# EAGLE design PulseFit-GFX (EAGLE 9.4.2)
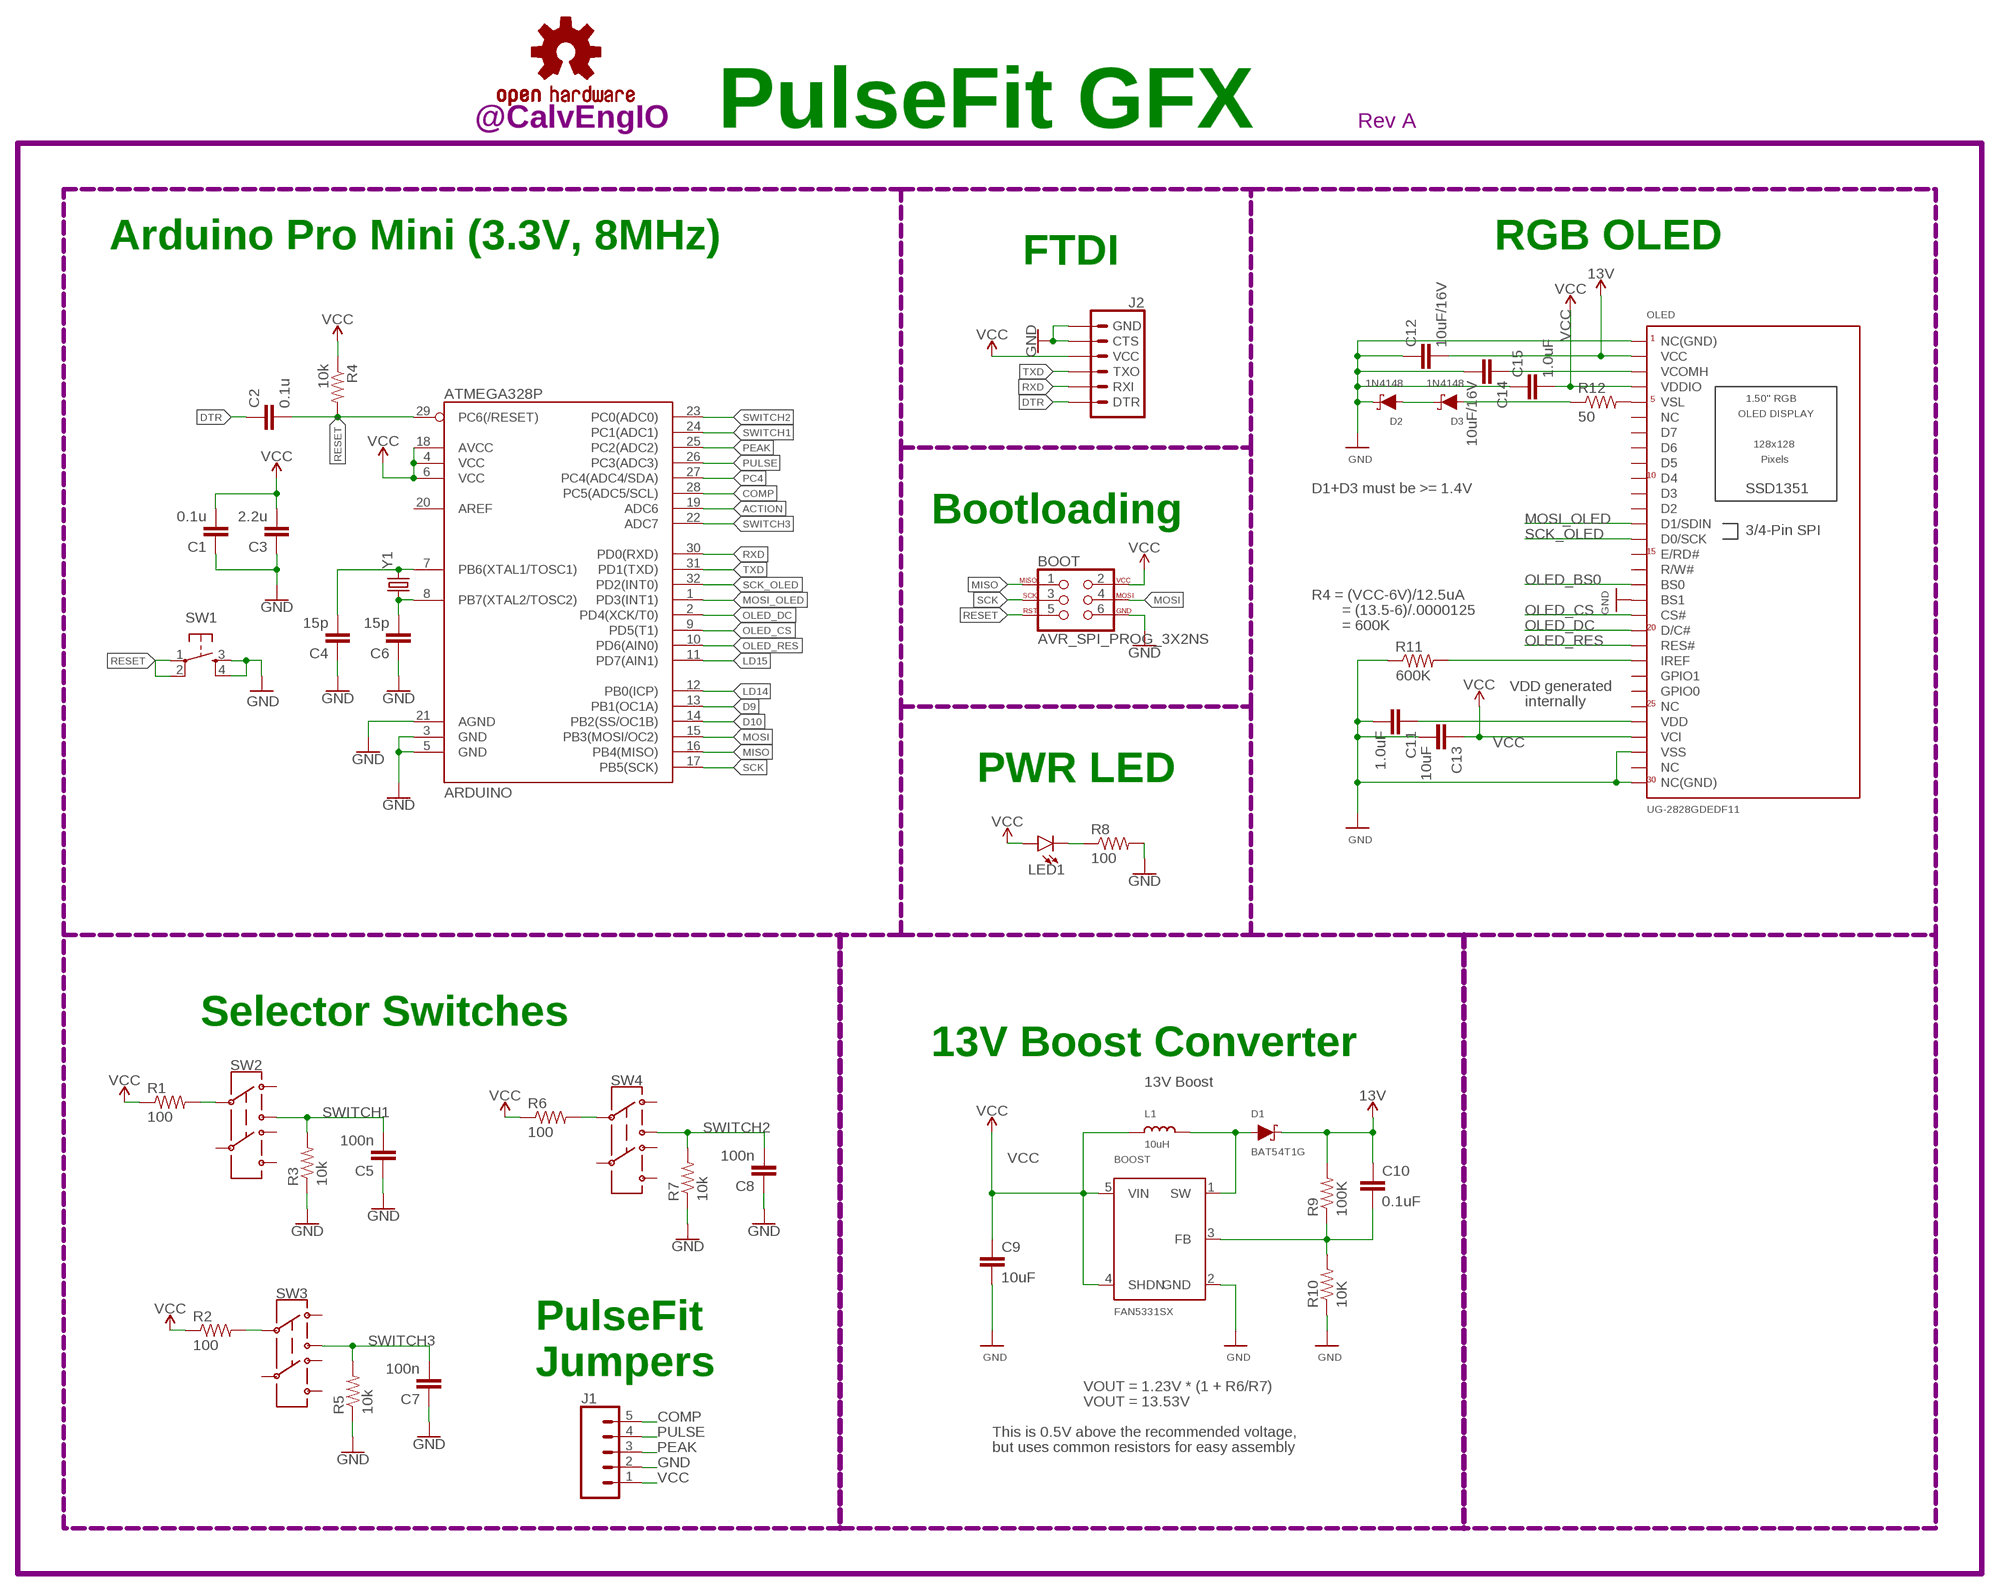
[diagram p0: schematic, sheet 1]

## Parts
ARDUINO  ATMEGA328P  ATMEGA328_SMT-OHMOD  [TQFP32-08]
BOOST  FAN5331SX  FAN5331  [SOT23-5@1]
BOOT  AVR_SPI_PROG_3X2NS  [2X3-NS]
C1  0.1u  CAPACITOR0603  [C0603]
C2  0.1u  CAPACITOR0603  [C0603]
C3  2.2u  CAPACITOR0805  [C0805]
C4  15p  CAPACITOR0603  [C0603]
C5  100n  CAPACITOR0603  [C0603]
C6  15p  CAPACITOR0603  [C0603]
C7  100n  CAPACITOR0603  [C0603]
C8  100n  CAPACITOR0603  [C0603]
C9  10uF  CAPACITOR0805  [C0805]
C10  0.1uF  CAPACITOR0603  [C0603]
C11  1.0uF  CAPACITOR0603  [C0603]
C12  10uF/16V  CAPACITOR0805  [C0805]
C13  10uF  CAPACITOR0805  [C0805]
C14  10uF/16V  CAPACITOR0805  [C0805]
C15  1.0uF  CAPACITOR0603  [C0603]
D1  BAT54T1G  SCHOTTKY-USC  [USC]
D2  1N4148  SCHOTTKY-USC  [USC]
D3  1N4148  SCHOTTKY-USC  [USC]
J1  CONN_05  [1X05]
J2  6_PIN_SERIAL_TARGETSILK  [6_PIN_SERIAL_TARGET_SIDE_W_SILK]
L1  10uH  INDUCTOR  [INDUCTOR_1007]
LED1  LED5MM  [LED_5MM]
LOGO1  CALVENGIO_HANDLEHANDLE.05  [CALVENGIO_HANDLE.05]
LOGO2  OSHW-LOGOS  [OSHW-LOGO-S]
LOGO3  REVISION.A  [REV.A]
OLED  UG-2828GDEDF11  DISP_OLED_UG-2828GDEDF11TOP  [FPC_XF2M-3015-1A]
R1  100  RESISTOR0603  [R0603]
R2  100  RESISTOR0603  [R0603]
R3  10k  RESISTOR0603  [R0603]
R4  10k  RESISTOR0603  [R0603]
R5  10k  RESISTOR0603  [R0603]
R6  100  RESISTOR0603  [R0603]
R7  10k  RESISTOR0603  [R0603]
R8  100  RESISTOR0603  [R0603]
R9  100K  RESISTOR0603  [R0603]
R10  10K  RESISTOR0603  [R0603]
R11  600K  RESISTOR0603  [R0603]
R12  50  RESISTOR0603  [R0603]
SW1  SPST-PTS830GG140  [BUTTON-GULLWING]
SW2  SWITCH.JS202011JXQNUPWARDS  [SWITCH.00]
SW3  SWITCH.JS202011JXQNUPWARDS  [SWITCH.00]
SW4  SWITCH.JS202011JXQNUPWARDS  [SWITCH.00]
Y1  CRYSTAL-CA-310  [CA-301]

## Nets
13V: C10.1 C12.2 D1.-(C) OLED.P$29(VCC) R9.2
ACTION: ARDUINO.19(ADC6)
COMP: ARDUINO.28(PC5(ADC5/SCL)) J1.5
D9: ARDUINO.13(PB1(OC1A))
D10: ARDUINO.14(PB2(SS/OC1B))
DTR: C2.1 J2.P$1(DTR)
GND: ARDUINO.3(GND) ARDUINO.5(GND) ARDUINO.21(AGND) BOOST.2(GND) BOOT.6 C1.1 C3.1 C4.1 C5.1 C6.1 C7.1 C8.1 C9.2 C11.2 C12.1 C13.2 C14.2 C15.1 D2.-(C) J1.2 J2.P$5(CTS) J2.P$6(GND) OLED.P$1(NC(GND)) OLED.P$3(VSS) OLED.P$13(BS1) OLED.P$30(NC(GND)) R3.1 R5.1 R7.1 R8.2 R10.1 R11.1 SW1.3 SW1.4
IREF: OLED.P$9(IREF) R11.2
LD14: ARDUINO.12(PB0(ICP))
LD15: ARDUINO.11(PD7(AIN1))
MISO: ARDUINO.16(PB4(MISO)) BOOT.1
MOSI: ARDUINO.15(PB3(MOSI/OC2)) BOOT.4
MOSI_OLED: ARDUINO.1(PD3(INT1)) OLED.P$18(D1/SDIN)
N$1: ARDUINO.7(PB6(XTAL1/TOSC1)) C4.2 Y1.2
N$2: ARDUINO.8(PB7(XTAL2/TOSC2)) C6.2 Y1.1
N$3: LED1.K(C) R8.1
N$4: C11.1 OLED.P$5(VDD)
N$5: BOOST.1(SW) D1.+(A) L1.P$2
N$6: OLED.P$26(VSL) R12.2
N$7: D3.+(A) R12.1
N$8: BOOST.3(FB) C10.2 R9.1 R10.2
N$9: R6.2 SW4.2
N$10: R2.2 SW3.2
N$11: R1.2 SW2.2
N$16: D2.+(A) D3.-(C)
OLED_BS0: OLED.P$14(BS0)
OLED_CS: ARDUINO.9(PD5(T1)) OLED.P$12(CS#)
OLED_DC: ARDUINO.2(PD4(XCK/T0)) OLED.P$11(D/C#)
OLED_RES: ARDUINO.10(PD6(AIN0)) OLED.P$10(RES#)
PC4: ARDUINO.27(PC4(ADC4/SDA))
PEAK: ARDUINO.25(PC2(ADC2)) J1.3
PULSE: ARDUINO.26(PC3(ADC3)) J1.4
RESET: ARDUINO.29(PC6(/RESET)) BOOT.5 C2.2 R4.2 SW1.1 SW1.2
RXD: ARDUINO.30(PD0(RXD)) J2.P$3(RXI)
SCK: ARDUINO.17(PB5(SCK)) BOOT.3
SCK_OLED: ARDUINO.32(PD2(INT0)) OLED.P$17(D0/SCK)
SWITCH1: ARDUINO.24(PC1(ADC1)) C5.2 R3.2 SW2.3
SWITCH2: ARDUINO.23(PC0(ADC0)) C8.2 R7.2 SW4.3
SWITCH3: ARDUINO.22(ADC7) C7.2 R5.2 SW3.3
TXD: ARDUINO.31(PD1(TXD)) J2.P$2(TXO)
VCC: ARDUINO.4(VCC) ARDUINO.6(VCC) ARDUINO.18(AVCC) BOOST.4(SHDN) BOOST.5(VIN) BOOT.2 C1.2 C3.2 C9.1 C13.1 C15.2 J1.1 J2.P$4(VCC) L1.P$1 LED1.A OLED.P$4(VCI) OLED.P$27(VDDIO) R1.1 R2.1 R4.1 R6.1
VCOMH1: C14.1 OLED.P$28(VCOMH)
Unconnected: ARDUINO.20(AREF) OLED.P$2(NC) OLED.P$6(NC) OLED.P$7(GPIO0) OLED.P$8(GPIO1) OLED.P$15(R/W#) OLED.P$16(E/RD#) OLED.P$19(D2) OLED.P$20(D3) OLED.P$21(D4) OLED.P$22(D5) OLED.P$23(D6) OLED.P$24(D7) OLED.P$25(NC) SW2.1 SW2.5 SW2.6 SW2.7 SW3.1 SW3.5 SW3.6 SW3.7 SW4.1 SW4.5 SW4.6 SW4.7

## Notes on the sheet
- PulseFit GFX
- Arduino Pro Mini (3.3V, 8MHz) | RGB OLED
- FTDI
- D1+D3 must be >= 1.4V
- Bootloading
- R4 = (VCC-6V)/12.5uA
- = (13.5-6)/.0000125
- = 600K
- VDD generated
- internally
- PWR LED
- Selector Switches
- 13V Boost Converter
- 13V Boost
- PulseFit
  Jumpers
- VOUT = 1.23V * (1 + R6/R7)
- VOUT = 13.53V
- This is 0.5V above the recommended voltage,
- but uses common resistors for easy assembly

## Library data of the parts
ARDUINO = SparkFun-DigitalIC:ATMEGA328_SMT-OHMOD: 32-Pin Atmega328 part Commonly used on Arduino compatible boards Available in QFP and QFN packages TQFP is IC-09069 QFN is non-stock; PROD_ID: IC-09069
BOOST = microbuilder:FAN5331: FAN5331 - LED/OLED 20V Boost Converter Digikey: FAN5331SXCT-ND
BOOT = CalvEngIO-Connectors:AVR_SPI_PROG_3X2: AVR ISP 6 Pin This is the reduced ISP connector for AVR programming. Common on Arduino. This footprint will take up less PCB space and can be used with a 10-pin to 6-pin adapter such as SKU: BOB-08508 **Special note about "TEST_POINT" package. The stop mask is on the top side, so if you want your programming test points to be on the bottom of your board, make sure to place this package on the bottom side of the board. This also ensure that the orientation to program from the bottom side will be correct. SparkFun Products: SparkFun ISP Pogo Adapter <https://www.sparkfun.com/products/11591> - NS Tiny AVR Programmer <https://www.sparkfun.com/products/11801> -PTH
C1-C15 = CalvEngIO-Passives:CAPACITOR
D1-D3 = CalvEngIO-DiscreteSemi:SCHOTTKY: Schottky diode A Schottky diode is a semiconductor diode which has a low forward voltage drop and a very fast switching action. Example: Digi-Key Part Number: RB161MM-20CT-ND
J1 = CalvEngIO-Connectors:CONN_05: Multi connection point. Often used as Generic Header-pin footprint for 0.1 inch spaced/style header connections On any of the 0.1 inch spaced packages, you can populate with these: Break Away Headers - Straight <https://www.sparkfun.com/products/116> (PRT-00116) Break Away Male Headers - Right Angle <https://www.sparkfun.com/products/553> (PRT-00553) Female Headers <https://www.sparkfun.com/products/115> (PRT-00115) Break Away Headers - Machine Pin <https://www.sparkfun.com/products/117> (PRT-00117) Break Away Female Headers - Swiss Machine Pin <https://www.sparkfun.com/products/743> (PRT-00743) For SCREWTERMINALS and SPRING TERMINALS visit here: Screw Terimnals on SparkFun.com <https://www.sparkfun.com/search/results?term=Screw+Terminals> (5mm/3.5mm/2.54mm spacing) This device is also useful as a general connection point to wire up your design to another part of your project. Our various solder wires solder well into these plated through hole pads. Hook-Up Wire - Assortment (Stranded, 22 AWG) <https://www.sparkfun.com/products/11375> (PRT-11375) Hook-Up Wire - Assortment (Solid Core, 22 AWG) <https://www.sparkfun.com/products/11367> (PRT-11367) View the entire wire category on our website here <https://www.sparkfun.com/categories/141> Special notes: Molex polarized connector foot print use with SKU : PRT-08231 with associated crimp pins and housings. 1MM SMD Version SKU: PRT-10208
J2 = SparkFun-Connectors:6_PIN_SERIAL_TARGET: 6-pin header connection for use with the "FTDI BASIC" pinout - TARGET SIDE. Also known as "Arduino Serial Program Header". It is used to mate with our FTDI Basic serial programmers using the Arduino IDE. Note, this device has "TARGET" in the name. It is intended to be used on a design that contains a target micro-controller that you wish to program. The "sister" device, named "CABLE" is inteneded to be used on a design that usually lives on the end of your USB cable and prvides the converter chip (FTDI232 or FTDI231x) to commnicate serial RX/TX. You can populate with some of these: Break Away Headers - Straight <https://www.sparkfun.com/products/116> (PRT-00116) For reference (or to suit your programming needs) check out these designs: SparkFun FTDI Basic Breakout - 5V <https://www.sparkfun.com/products/9716> (DEV-09716) SparkFun FTDI Basic Breakout - 3.3V <https://www.sparkfun.com/products/9873> (DEV-09873) SparkFun FTDI SmartBasic <https://www.sparkfun.com/products/12935> (DEV-12935) SparkFun Beefy 3 - FTDI Basic Breakout <https://www.sparkfun.com/products/13746> (DEV-13746)
L1 = microbuilder:INDUCTOR: Inductors 0603: 10nH Ceramic Inductor - microwire antenna/RF (Digikey: 712-1434-2-ND) 0805: 560nH Ceramic Inductor - RF (Digikey: 553-1047-1-ND) 270nH Ceramic Inductor - Q = 40@250MHz, +-5%, 1 Ohm DC Resistance (Digikey: 535-10506-2-ND) 1007 (2518 Metric) SMT: 10µH 10% 250mOhm 820mA 1007 Inductor (Digikey: 587-2189-1-ND) 22µH 10% 500mOhm 580mA 1007 Inductor (Digikey: 587-2190-1-ND) 47µH 10% 950mOhm 420mA 1007 Inductor (Digikey: 587-2191-1-ND) 47µH 5% 100mOhm 1A 1008 Inductor (Digikey: 732-1816-1-ND) 5.0x5.0mm (Taiyo Yuden NR5040 Series) 6.8µH 20% 2.3A 64mOhm Inductor (Digikey: 587-2374-2-ND) 5.0x5.0mm (TDK VLC5045 Series) 4.7µH 20% 3.3A 34mOhm Inductor (Digikey: 445-6526-1-ND) 6.8µH 20% 2.7A 46mOhm Inductor (Digikey: 445-6527-1-ND) 6.0x6.0mm (TDK VLC6045 Series) 4.7µH 20% 3.8A 27mOhm Inductor (Digikey: 445-6538-2-ND) 6.8µH 20% 3A 41mOhm Inductor (Digikey: 445-6540-1-ND) 6.2µH 30% 2.2A 45mOhm Inductor (Digikey: SRR5028-6R2YCT-ND) - Not TDK VLC6045 but footprint should match 6.0x6.0mm (TDK SLF6045 Series) 6.8uH 30% 2A 33mOhm Inductor (Digikey: 445-4572-1-ND, Mouser: 810-SLF645T6R8N2R0PF) 6.0x6.0mm (Sumida CDRH5D28 Series) 6.2uH 30% 1.8A 45mOhm Inductor (Digikey: 308-1542-1-ND) Taiyo Yuden NR3015T2R2M - 2.2uH 20% 1.5A (Digikey: 587-1648-2-ND, Mouser: 963-NR3015T2R2M) - Used with TI TPS62172 CoilCraft RFID Transponder Coil - MA5532-AE (For use with AS3935 Lightning Sensor)
LED1 = CalvEngIO-LED:LED: LED (Generic) Standard schematic elements and footprints for 5mm, 3mm, 1206, and 0603 sized LEDs. Generic LEDs with no color specified. LTST-C190KGKT: arrow indicates cathode
LOGO1 = CalvEngIO-Logos:CALVENGIO_HANDLE
LOGO2 = CalvEngIO-Logos:OSHW-LOGO: Open-Source Hardware (OSHW) Logo This logo indicates the piece of hardware it is found on incorporates a OSHW license and/or adheres to the definition of open source hardware found here: http://freedomdefined.org/OSHW
LOGO3 = CalvEngIO-Logos:REVISION.A
OLED = microbuilder:DISP_OLED_UG-2828GDEDF11: 128x128 1.5" RGB OLED - UG-2828GDEDF11 30-Pin 0.5mm Pitch FPC Cable (Top+Bottom Contacts) - OMRON XF2M-3015-1A (Digikey: OR723TR-ND) This FPC connector has contacts on the top and bottom, but the appropriate pin needs to be selected depending on whether the OLED will be inserted right-side up (use the TOP pinout) or upside-down (use the BOTTOM pinout).
R1-R12 = CalvEngIO-Passives:RESISTOR
SW1 = CalvEngIO-Switches:SPST-PTS830GG140
SW2-SW4 = CalvEngIO-Switches:SWITCH.JS202011JXQN: Manufacturer's Part Numer: JS202011JAQN for right angle throw JS202011JCQN for top side throw
Y1 = CalvEngIO-Clocks:CRYSTAL-CA-310

## Board
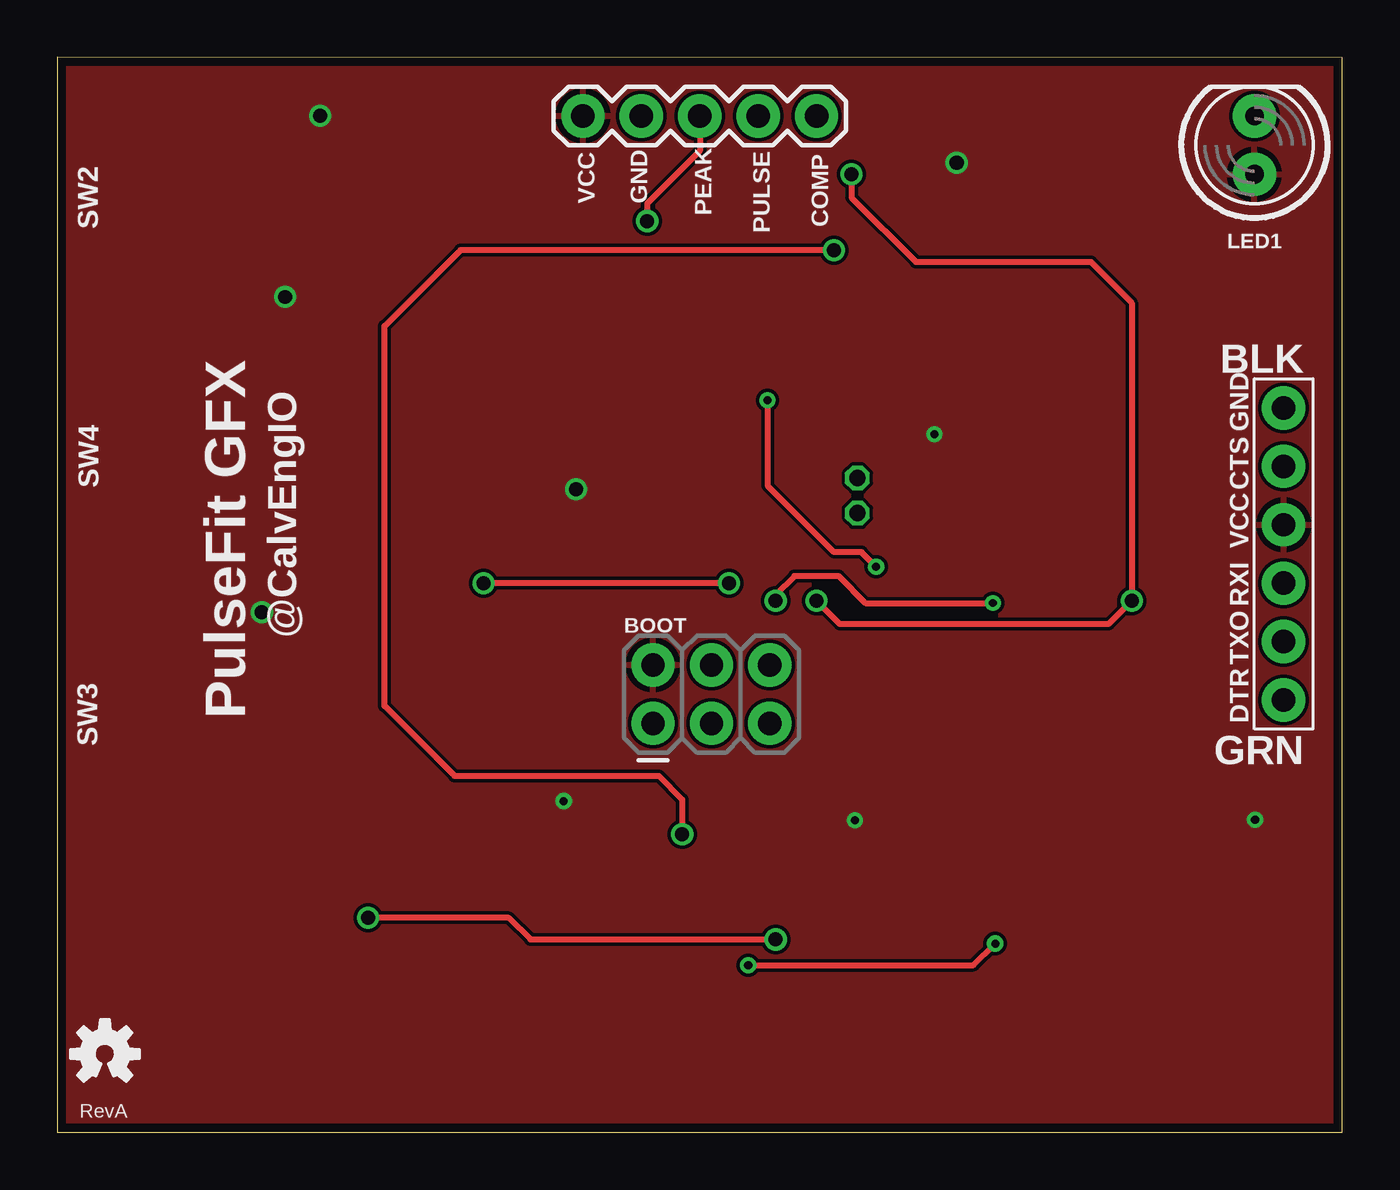
[diagram p1: board, top side]
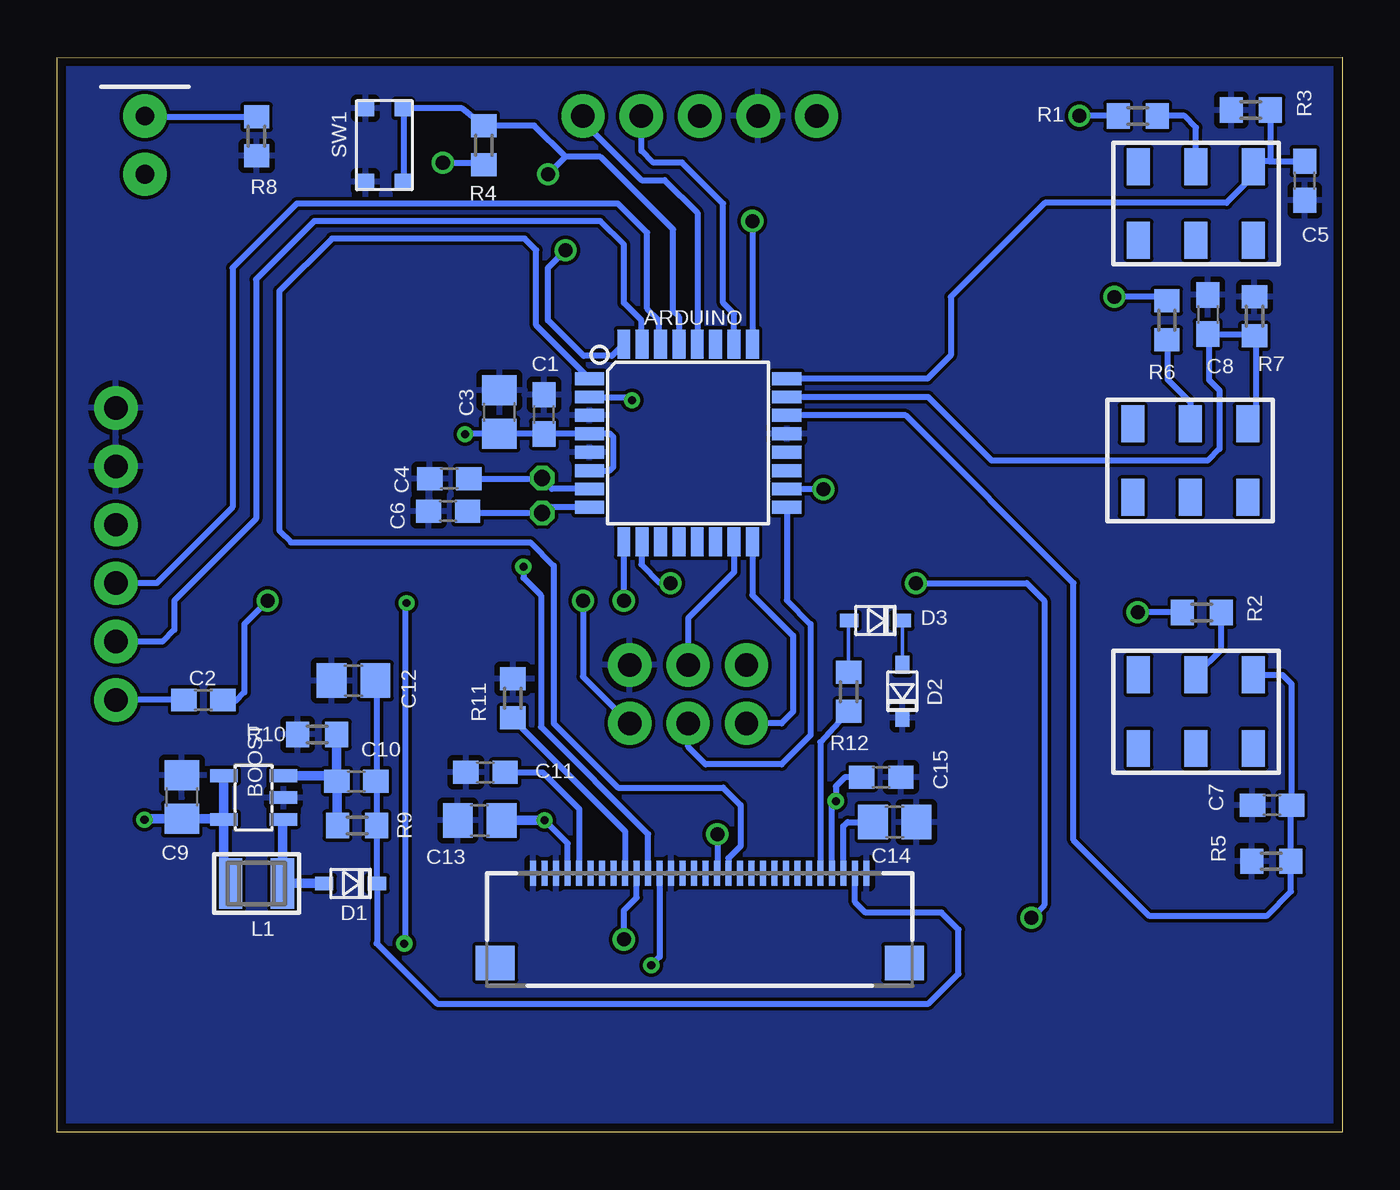
[diagram p2: board, bottom side, seen from below]

Size 55.88 x 46.74 mm. Coordinates in mm from the lower left corner, seen from the top.
Outline: 0,0 55.88,0 55.88,46.73 0,46.74 0,0
Copper layers (1*16): Top 0.0356mm / dielectric 1.5011mm / Bottom 0.0356mm
Design rules "LaenPCBOrder": minimum track width 6mil, minimum drill 13mil, track to track 6mil, track to pad 6mil, pad to pad 6mil, via to via 6mil, smd to smd 6mil, copper to edge 15mil, drill to drill 6mil, minimum pad ring 7mil, minimum via ring 7mil, stop-mask expansion 3mil, vias tented up to drill 0mil, thermal gap 10mil

### Footprints (pad centres in the part's own frame; a part is rotated, then mirrored left to right if it is on the bottom)
TQFP32-08 = smd 1.27 x 0.559: 1 -4.293,2.8; 2 -4.293,2; 3 -4.293,1.2; 4 -4.293,0.4; 5 -4.293,-0.4; 6 -4.293,-1.2; 7 -4.293,-2; 8 -4.293,-2.8; 17 4.293,-2.8; 18 4.293,-2; 19 4.293,-1.2; 20 4.293,-0.4; 21 4.293,0.4; 22 4.293,1.2; 23 4.293,2; 24 4.293,2.8 | smd 0.559 x 1.27: 9 -2.8,-4.293; 10 -2,-4.293; 11 -1.2,-4.293; 12 -0.4,-4.293; 13 0.4,-4.293; 14 1.2,-4.293; 15 2,-4.293; 16 2.8,-4.293; 25 2.8,4.293; 26 2,4.293; 27 1.2,4.293; 28 0.4,4.293; 29 -0.4,4.293; 30 -1.2,4.293; 31 -2,4.293; 32 -2.8,4.293
SOT23-5@1 = smd 0.55 x 1.2: 1 -0.95,-1.3; 2 0,-1.3; 3 0.95,-1.3; 4 0.95,1.3; 5 -0.95,1.3
2X3-NS = drill 1.016 pad 1.88: 1 -2.54,-1.27; 2 -2.54,1.27; 3 0,-1.27; 4 0,1.27; 5 2.54,-1.27; 6 2.54,1.27
C0603 = smd 1.1 x 1: 1 -0.85,0; 2 0.85,0
C0805 = smd 1.3 x 1.5: 1 -0.95,0; 2 0.95,0
USC = smd 0.8 x 0.6: + -1.15,0; - 1.15,0
1X05 = drill 1.016 pad 1.88: 1 0,0; 2 2.54,0; 3 5.08,0; 4 7.62,0; 5 10.16,0
6_PIN_SERIAL_TARGET_SIDE_W_SILK = drill 1.016 pad 1.88: P$1 -6.35,0; P$2 -3.81,0; P$3 -1.27,0; P$4 1.27,0; P$5 3.81,0; P$6 6.35,0
INDUCTOR_1007 = smd 1.016 x 2.2: P$1 -1.127,0; P$2 1.127,0
LED_5MM = drill 0.813 pad 1.88: A -1.27,0; K 1.27,0
FPC_XF2M-3015-1A = smd 0.25 x 1.1: P$1 7.25,-2.63; P$2 6.75,-2.63; P$3 6.25,-2.63; P$4 5.75,-2.63; P$5 5.25,-2.63; P$6 4.75,-2.63; P$7 4.25,-2.63; P$8 3.75,-2.63; P$9 3.25,-2.63; P$10 2.75,-2.63; P$11 2.25,-2.63; P$12 1.75,-2.63; P$13 1.25,-2.63; P$14 0.75,-2.63; P$15 0.25,-2.63; P$16 -0.25,-2.63; P$17 -0.75,-2.63; P$18 -1.25,-2.63; P$19 -1.75,-2.63; P$20 -2.25,-2.63; P$21 -2.75,-2.63; P$22 -3.25,-2.63; P$23 -3.75,-2.63; P$24 -4.25,-2.63; P$25 -4.75,-2.63; P$26 -5.25,-2.63; P$27 -5.75,-2.63; P$28 -6.25,-2.63; P$29 -6.75,-2.63; P$30 -7.25,-2.63 | smd 1.7 x 1.5: SUPPORT1 8.9,1.27; SUPPORT2 -8.9,1.27
R0603 = smd 1 x 1.1: 1 -0.85,0; 2 0.85,0
BUTTON-GULLWING = smd 0.7 x 0.75: 1 -1.6,0.825; 2 1.6,0.825; 3 -1.6,-0.825; 4 1.6,-0.825
SWITCH.00 = smd 1 x 1.6: 1 -2.5,1.6; 2 0,1.6; 3 2.5,1.6; 5 -2.5,-1.6; 6 0,-1.6; 7 2.5,-1.6
CA-301 = drill 0.711 octagon: 1 0,0; 2 1.524,0

### Placement (x,y rotation side)
ARDUINO  28.45,29.97 0 bottom
BOOST  47.35,14.55 90 bottom
BOOT  28.45,19.05 0 top
C1  34.72,31.22 270 bottom
C2  49.53,18.8 0 bottom
C3  36.65,31.32 270 bottom
C4  38.84,28.42 0 bottom
C5  1.63,41.38 90 bottom
C6  38.89,27 0 bottom
C7  3.05,14.22 0 bottom
C8  5.84,35.56 270 bottom
C9  50.47,14.58 90 bottom
C10  42.88,15.27 180 bottom
C11  37.26,15.65 180 bottom
C12  43,19.63 0 bottom
C13  37.52,13.56 180 bottom
C14  19.46,13.49 0 bottom
C15  20.04,15.44 180 bottom
D1  43.13,10.82 0 bottom
D2  19.13,19.18 270 bottom
D3  20.29,22.25 0 bottom
J1  22.86,44.2 0 top
J2  53.34,25.15 90 top
L1  47.22,10.82 0 bottom
LED1  52.07,42.93 90 top
LOGO1  9.12,27.15 270 top
LOGO2  2.06,3.4 0 top
LOGO3  3.05,1.24 180 top
OLED  27.94,8.64 180 bottom
R1  8.89,44.2 0 bottom
R2  6.1,22.61 0 bottom
R3  3.96,44.45 0 bottom
R4  37.34,42.93 90 bottom
R5  3.07,11.79 0 bottom
R6  7.62,35.31 270 bottom
R7  3.81,35.48 270 bottom
R8  47.22,43.31 270 bottom
R9  42.85,13.34 0 bottom
R10  44.58,17.3 0 bottom
R11  36.07,18.87 270 bottom
R12  21.46,19.15 270 bottom
SW1  41.66,42.93 270 bottom
SW2  6.35,40.39 0 bottom
SW3  6.35,18.29 0 bottom
SW4  6.6,29.21 0 bottom
Y1  34.8,26.92 90 top

### Tracks (layer width: path | path; a pad name or v marks a point on that pad's centre or on a via)
13V
  Bottom 0.254: 42.02,19.61 C12.2 42,19.58 42,15.24 | C10.1 42,15.24 | 42,15.24 R9.2 42,10.84 D1.- 41.98,8.24 42,8.22 39.37,5.59 17.98,5.59 16.69,6.88 16.69,8.81 17.42,9.55 20.73,9.55 21.18,10.01 OLED.P$29
COMP
  Bottom 0.254: J1.5 33.02,43.94 30.48,41.4 29.46,41.4 28.05,39.99 ARDUINO.28
DTR
  Bottom 0.254: C2.1 J2.P$1
GND
  pour Bottom: -0.76,46.74 55.88,46.74 55.88,-0.25 -0.76,-0.25
IREF
  Bottom 0.254: OLED.P$9 31.19,13.08 36.07,17.96 R11.2
MISO
  Bottom 0.254: ARDUINO.16 25.65,23.36 23.88,21.59 23.88,18.29 24.38,17.78 BOOT.1
MOSI
  Bottom 0.254: ARDUINO.15 26.45,24.35 28.45,22.35 BOOT.4
MOSI_OLED
  Bottom 0.254: OLED.P$18 26.69,11.92 26.16,12.45 26.16,14.22 26.92,14.99 31.5,14.99 34.29,17.78 34.29,24.64 35.31,25.65 45.72,25.65 46.23,26.16 46.23,36.58 43.94,38.86 35.56,38.86 35.05,38.35 35.05,35.08 ARDUINO.1
N$1
  Bottom 0.254: C4.2 34.82,28.42 | 34.82,28.42 Y1.2 | ARDUINO.7 34.37,27.97 34.82,28.42
N$2
  Bottom 0.254: ARDUINO.8 34.55,27.17 Y1.1 37.99,26.92 C6.2
N$3
  Bottom 0.254: LED1.K 52.03,44.16 R8.1
N$4
  Bottom 0.254: C11.1 34.77,15.65 33.19,14.06 OLED.P$5
N$5
  Bottom 0.406: D1.+ L1.P$2 46.09,13.56 BOOST.1
N$6
  Bottom 0.254: R12.2 22.69,16.96 OLED.P$26
N$7
  Bottom 0.152: R12.1 21.46,22.23 D3.+
N$8
  Bottom 0.254: R10.2
  Bottom 0.406: R10.2 C10.2 | C10.2 43.73,13.36 R9.1 | C10.2 43.96,15.5 BOOST.3
N$9
  Bottom 0.254: R6.2 7.59,34.43 7.59,32.74 6.6,31.75 SW4.2
N$10
  Bottom 0.254: SW3.2 5.25,20.99 R2.2
N$11
  Bottom 0.254: SW2.2 6.35,43.69 6.86,44.2 R1.2
N$16
  Bottom 0.152: D2.+ 19.13,22.23 D3.-
OLED_CS  (via drill 0.33, 0.35, 0.61)
  Top 0.254: v40.69,23.01 35.15,23.01 33.98,24.18 32.05,24.18 31.24,23.37 v31.24,23.11 | v30.05,7.26 39.85,7.26 v40.79,8.2
  Bottom 0.254: ARDUINO.9 v31.25,23.12 v31.24,23.11 | v40.69,23.01 40.77,22.94 40.77,8.23 v40.79,8.2 | OLED.P$12 29.69,7.62 v30.05,7.26
OLED_DC  (via drill 0.35)
  Top 0.254: v35.61,24.59 34.98,25.22 33.78,25.22 30.89,28.12 v30.89,31.83
  Bottom 0.254: OLED.P$11 30.19,12.97 34.85,17.63 34.85,23.34 35.61,24.11 v35.61,24.59 | 32.8,32.03 ARDUINO.2 | ARDUINO.2 | ARDUINO.2 31.03,31.97 v30.89,31.83
OLED_RES  (via drill 0.61)
  Top 0.254: v29.21,23.88 v18.54,23.88 | v13.51,9.32 19.63,9.32 20.57,8.38 v31.24,8.38
  Bottom 0.254: ARDUINO.10 30.48,25.65 30.48,24.69 29.67,23.88 v29.21,23.88 | v18.54,23.88 13.72,23.88 12.95,23.11 12.95,9.88 v13.51,9.32 | v31.24,8.38 31.24,9.65 30.69,10.2 OLED.P$10
PEAK  (via drill 0.61)
  Top 0.254: J1.3 27.94,42.67 25.65,40.39 v25.65,39.62
  Bottom 0.254: v25.65,39.62 25.65,34.27 ARDUINO.25
PULSE
  Bottom 0.254: ARDUINO.26 26.45,35.59 26.92,36.07 26.92,40.39 28.7,42.16 29.97,42.16 30.48,42.67 J1.4
RESET  (via drill 0.61)
  Top 0.254: v34.54,41.66 34.54,40.64 37.34,37.85 44.96,37.85 46.74,36.07 v46.74,23.11 45.72,22.1 34.04,22.1 v33.02,23.11
  Bottom 0.254: SW1.2 SW1.1 38.29,44.53 R4.2 35.14,43.78 33.78,42.42 | 49.02,18.94 C2.2 48.18,18.8 48.13,18.75 47.75,19.13 47.75,22.1 v46.74,23.11 | ARDUINO.29 28.85,35.45 29.1,35.71 29.1,39.26 32.26,42.42 33.78,42.42 | v33.02,23.11 33.02,19.81 BOOT.5 | 33.78,42.42 v34.54,41.66
RXD
  Bottom 0.254: ARDUINO.30 29.72,34.34 29.72,35.31 30.23,35.81 30.23,39.12 31.5,40.39 45.47,40.39 48.26,37.59 48.26,27.18 51.56,23.88 J2.P$3
SCK
  Bottom 0.254: ARDUINO.17 24.16,23.14 23.11,22.1 23.11,17.27 24.38,16 27.69,16 28.45,16.76 BOOT.3
SCK_OLED  (via drill 0.61)
  Top 0.254: v33.78,38.35 17.53,38.35 14.22,35.05 14.22,18.54 17.27,15.49 26.16,15.49 27.18,14.48 v27.18,12.95
  Bottom 0.254: v27.18,12.95 27.18,11.28 OLED.P$17 | ARDUINO.32 31.76,33.76 32.99,33.76 34.54,35.31 34.54,37.59 v33.78,38.35
SWITCH1
  Bottom 0.254: 3.56,42.28 SW2.3 | SW2.3 3.85,41.59 5.03,40.41 12.93,40.41 17.02,36.32 17.02,33.78 18.03,32.77 ARDUINO.24 | SW2.3 3.58,42.25 3.15,42.25 | C5.2 3.17,42.23 3.15,42.25 | R3.2 3.11,42.29 3.15,42.25
SWITCH2
  Bottom 0.254: SW4.3 3.75,31.17 3.75,34.57 R7.2 3.81,34.71 C8.2 5.79,34.66 5.79,32.72 5.33,32.26 5.33,29.72 5.84,29.21 15.24,29.21 18,31.97 ARDUINO.23
SWITCH3
  Bottom 0.254: ARDUINO.22 18.98,31.17 11.68,23.88 11.68,12.7 8.38,9.4 3.3,9.4 2.22,10.48 R5.2 2.22,14.2 C7.2 2.2,19.5 2.59,19.89 SW3.3
TXD
  Bottom 0.254: ARDUINO.31 30.48,34.3 30.48,35.31 31.24,36.07 31.24,38.61 32.26,39.62 44.7,39.62 47.24,37.08 47.24,26.67 50.8,23.11 50.8,21.84 51.31,21.34 J2.P$2
VCC  (via drill 0.35, 0.6, 0.61)
  Bottom 0.254: R1.1 v11.43,44.2 | R2.1 v8.89,22.61 | BOOST.5 48.71,13.54 | BOOST.4 48.71,15.57 | v9.91,36.32 7.79,36.32 R6.1 | v39.12,42.16 37.43,42.16 R4.1 | ARDUINO.18 v22.56,27.97 v22.55,27.96 | v38.15,30.35 38.14,30.37 C3.2 C1.2 ARDUINO.4 31.85,30.38 31.7,30.23 31.7,28.93 31.86,28.77 ARDUINO.6 | OLED.P$4 33.69,12.56 v34.7,13.56 | OLED.P$27 22.19,14.23 v22.02,14.4 22.02,15.04 21.61,15.44 C15.2
  Bottom 0.406: BOOST.4 BOOST.5 48.65,11.12 L1.P$1 | 48.71,13.54 48.8,13.63 C9.1 52.05,13.63 v52.09,13.59 | C13.1 v34.7,13.56
  pour Top: -1.52,46.74 55.88,46.74 55.88,-0.25 -1.52,-0.25
VCOMH1
  Bottom 0.254: OLED.P$28 21.69,13.31 21.51,13.49 C14.1

### Text on the board
tPlace: PulseFit GFX
tNames: VCC | GND | PEAK | PULSE | COMP
bNames: D2